# EAGLE design badge-v2 (EAGLE 6.2)
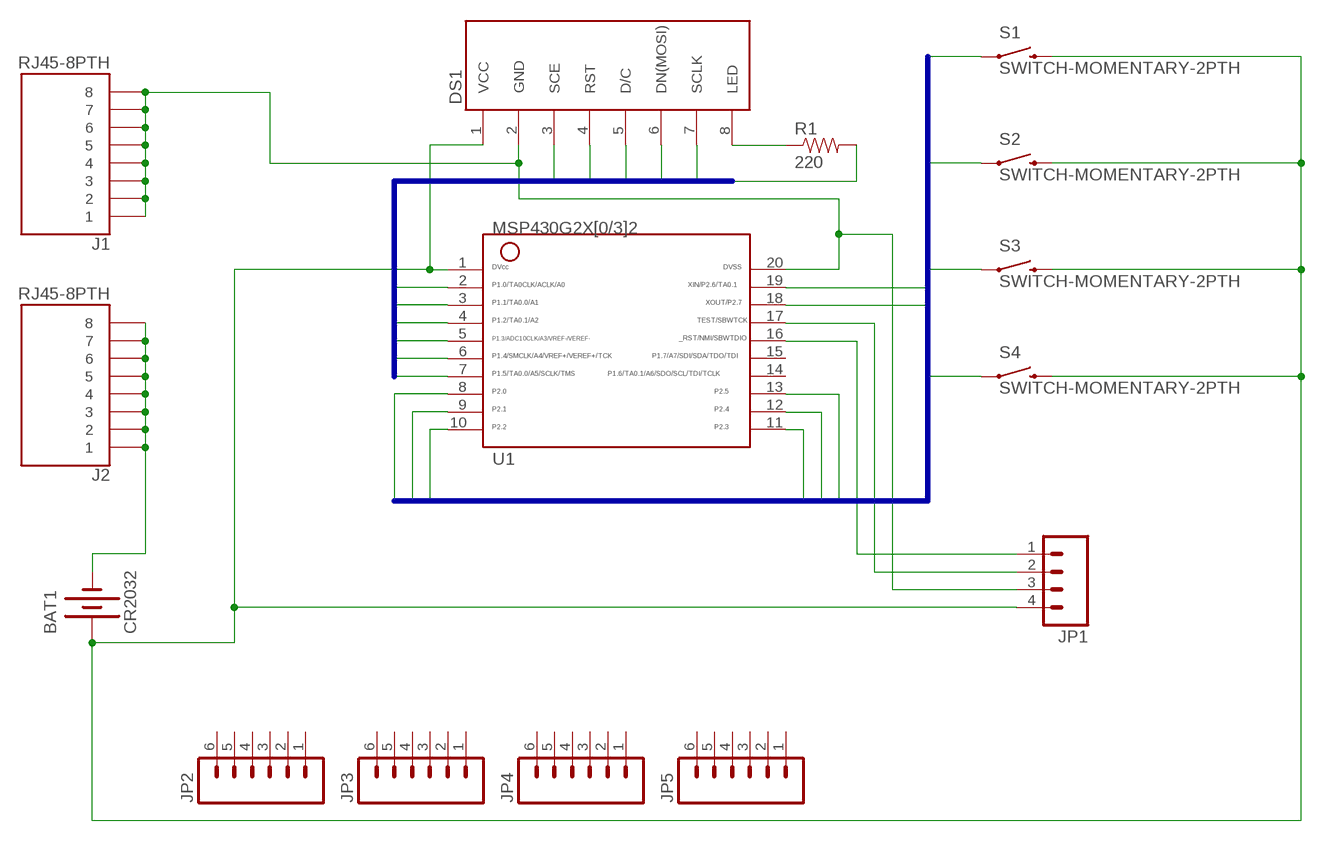
[diagram p0: schematic, sheet 1]

## Parts
BAT1  CR2032  BATTERY  [BATTCOM_20MM_4LEGS_PTH]
DS1  NOK_5110_LCD  [1X08]
J1  RJ45-8PTH  [RJ45-8]
J2  RJ45-8PTH  [RJ45-8]
JP1  M04PTH  [1X04]
JP2  M06SIP  [1X06]
JP3  M06SIP  [1X06]
JP4  M06SIP  [1X06]
JP5  M06SIP  [1X06]
R1  220  RESISTORAXIAL-0.3  [AXIAL-0.3]
S1  SWITCH-MOMENTARY-2PTH  [TACTILE-PTH]
S2  SWITCH-MOMENTARY-2PTH  [TACTILE-PTH]
S3  SWITCH-MOMENTARY-2PTH  [TACTILE-PTH]
S4  SWITCH-MOMENTARY-2PTH  [TACTILE-PTH]
U1  G2X[0/3]2---N20  [N20]

## Nets
N$1: DS1.8(LED) R1.P$1
PORTONE0: DS1.4(RST) U1.2
PORTONE1: DS1.5(D/C) U1.3
PORTONE2: DS1.6(DN(MOSI)) U1.4
PORTONE3: DS1.7(SCLK) U1.5
PORTONE4: R1.P$2 U1.6
PORTONE5: DS1.3(SCE) U1.7
PORTTWO0: S1.1 U1.8
PORTTWO1: S2.1 U1.9
PORTTWO2: S3.1 U1.10
PORTTWO3: S4.1 U1.11
PORTTWO4: U1.12
PORTTWO5: U1.13
PORTTWO6: U1.19
PORTTWO7: U1.18
RST: JP1.1 U1.16
TEST: JP1.2 U1.17
VCC: BAT1.P$POS1(+) DS1.1(VCC) JP1.4 S1.3 S2.3 S3.3 S4.3 U1.1
VSS1: BAT1.P$NEG(-) J2.1 J2.2 J2.3 J2.4 J2.5 J2.6 J2.7 J2.8
VSS2: DS1.2(GND) J1.1 J1.2 J1.3 J1.4 J1.5 J1.6 J1.7 J1.8 JP1.3 U1.20
Unconnected: JP2.1 JP2.2 JP2.3 JP2.4 JP2.5 JP2.6 JP3.1 JP3.2 JP3.3 JP3.4 JP3.5 JP3.6 JP4.1 JP4.2 JP4.3 JP4.4 JP4.5 JP4.6 JP5.1 JP5.2 JP5.3 JP5.4 JP5.5 JP5.6 U1.14 U1.15

## Buses
PORTONE[0..5]
PORTTWO[0..7]

## Library data of the parts
BAT1 = badge-custom:BATTERY: Battery Holders Various common sizes : AA, AAA, 20mm coin cell and 12mm coin cell.
DS1 = badge-custom:NOK_5110_LCD
J1 J2 = SparkFun:RJ45-8: RJ45 Jack Simple RJ45, 8-pin connection - connector for common Cat5, Cat5e, and Cat6 Ethernet cables. Footprint not yet proven in production. Connector sku is PRT-00643; Breakout PCB sku is BOB-00716.
JP1 = SparkFun:M04: Header 4 Standard 4-pin 0.1" header. Use with straight break away headers (SKU : PRT-00116), right angle break away headers (PRT-00553), swiss pins (PRT-00743), machine pins (PRT-00117), and female headers (PRT-00115). Molex polarized connector foot print use with SKU : PRT-08231 with associated crimp pins and housings. 1MM SMD Version SKU: PRT-10208
JP2-JP5 = SparkFun:M06: Header 6 Standard 6-pin 0.1" header. Use with straight break away headers (SKU : PRT-00116), right angle break away headers (PRT-00553), swiss pins (PRT-00743), machine pins (PRT-00117), and female headers (PRT-00115). Molex polarized connector foot print use with SKU : PRT-08094 with associated crimp pins and housings. NOTES ON THE VARIANTS LOCK and LOCK_LONGPADS... This footprint was designed to help hold the alignment of a through-hole component (i.e. 6-pin header) while soldering it into place. You may notice that each hole has been shifted either up or down by 0.005 of an inch from it's more standard position (which is a perfectly straight line). This slight alteration caused the pins (the squares in the middle) to touch the edges of the holes. Because they are alternating, it causes a "brace" to hold the component in place. 0.005 has proven to be the perfect amount of "off-center" position when using our standard breakaway headers. Although looks a little odd when you look at the bare footprint, once you have a header in there, the alteration is very hard to notice. Also, if you push a header all the way into place, it is covered up entirely on the bottom side. This idea of altering the position of holes to aid alignment will be further integrated into the Sparkfun Library for other footprints. It can help hold any component with 3 or more connection pins.
R1 = SparkFun:RESISTOR: Resistor Basic schematic elements and footprints for 0603, 1206, and PTH resistors.
S1-S4 = SparkFun:SWITCH-MOMENTARY-2
U1 = TI_MSP430_v16:G2X[0/3]2---N20: MSP430G2X[0/3]2 MSP430G2x32, MSP430G2x02 PDIP (N) 20 Pin Package http://focus.ti.com/docs/prod/folders/print/msp430g2432.html

## Board
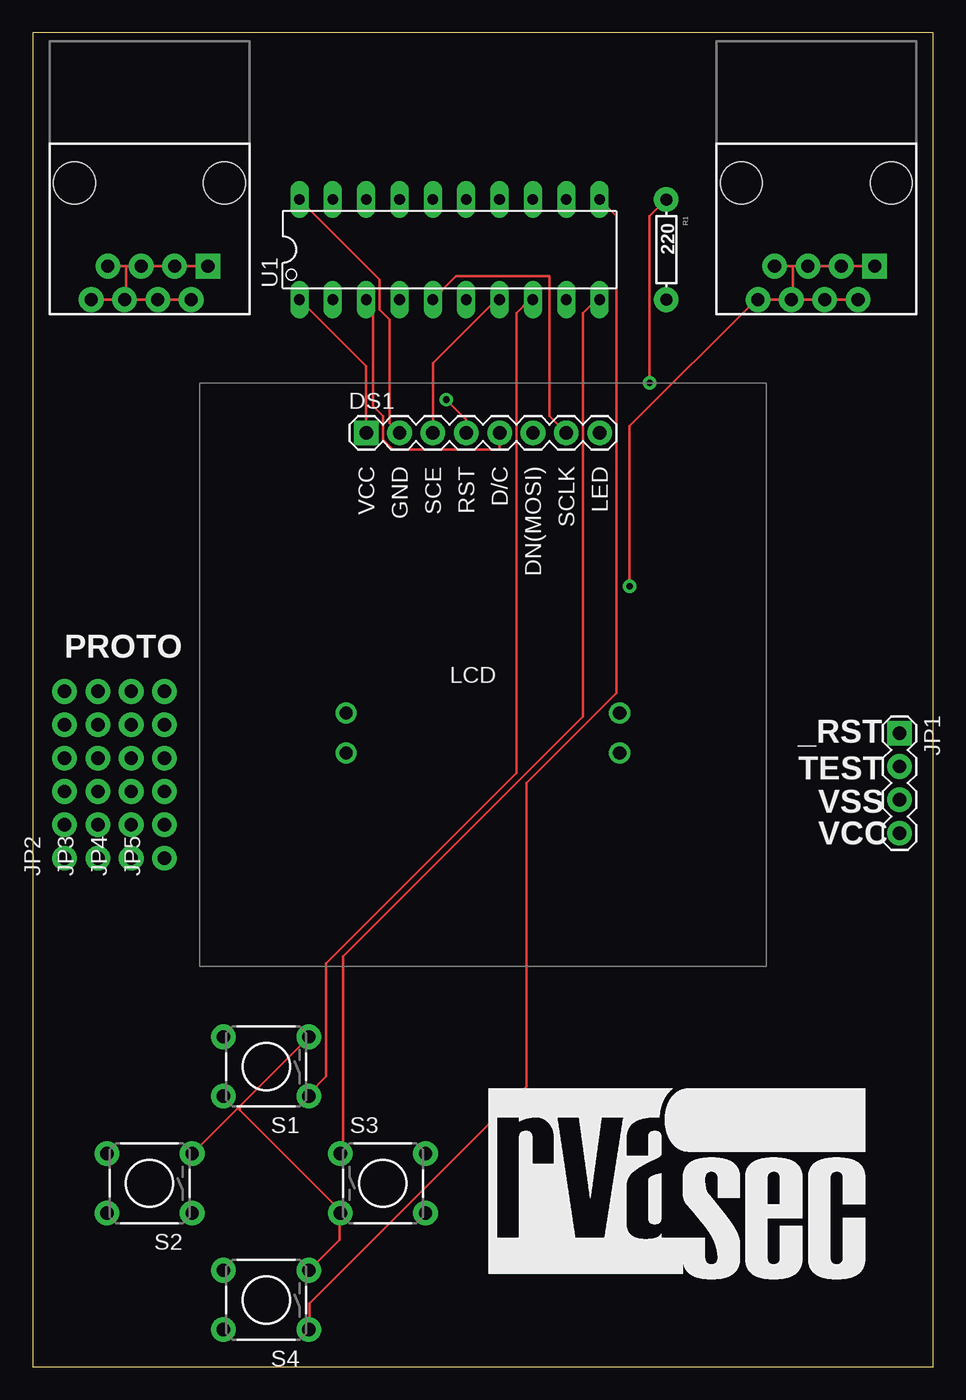
[diagram p1: board, top side]
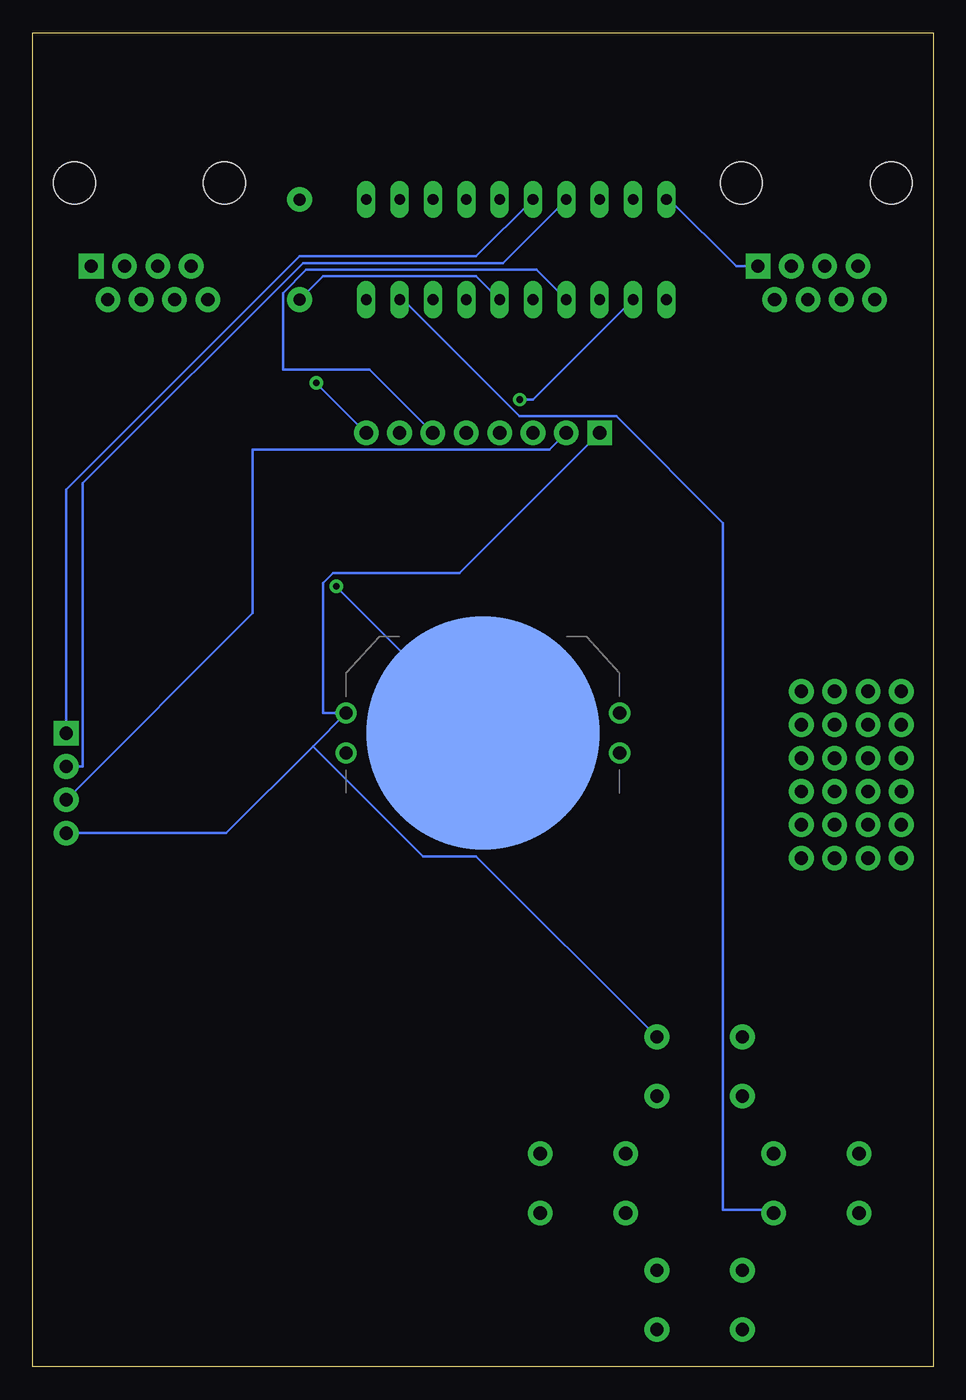
[diagram p2: board, bottom side, seen from below]

Size 68.58 x 101.6 mm. Coordinates in mm from the lower left corner, seen from the top.
Outline: 0,0 68.58,0 68.58,101.6 0,101.6 0,0
Copper layers (1*16): Top 0.035mm / dielectric 1.5mm / Bottom 0.035mm
Design rules: minimum track width 8mil, minimum drill 20mil, track to track 8mil, track to pad 8mil, pad to pad 8mil, via to via 8mil, smd to smd 8mil, copper to edge 10mil, drill to drill 8mil, minimum pad ring 12mil, minimum via ring 10mil, stop-mask expansion 4mil, vias tented up to drill 25mil, thermal gap 10mil

### Footprints (pad centres in the part's own frame; a part is rotated, then mirrored left to right if it is on the bottom)
BATTCOM_20MM_4LEGS_PTH = smd 17.78 x 17.78: P$NEG 0,0 | drill 1: P$POS1 -10.414,1.524; P$POS2 -10.414,-1.524; P$POS3 10.414,1.524; P$POS4 10.414,-1.524
1X08 = drill 1.016 pad 1.88 square: 1 0,0 | drill 1.016 pad 1.88: 2 2.54,0; 3 5.08,0; 4 7.62,0; 5 10.16,0; 6 12.7,0; 7 15.24,0; 8 17.78,0
RJ45-8 = drill 1 pad 1.88 square: 1 -4.445,6.35 | drill 1 pad 1.88: 2 -3.175,8.89; 3 -1.905,6.35; 4 -0.635,8.89; 5 0.635,6.35; 6 1.905,8.89; 7 3.175,6.35; 8 4.445,8.89 | hole 3.2: -5.715,0; 5.715,0
1X04 = drill 1.016 pad 1.88 square: 1 0,0 | drill 1.016 pad 1.88: 2 2.54,0; 3 5.08,0; 4 7.62,0
1X06 = drill 1.016 pad 1.88: 1 0,0; 2 2.54,0; 3 5.08,0; 4 7.62,0; 5 10.16,0; 6 12.7,0
AXIAL-0.3 = drill 0.9 pad 1.88: P$1 -3.81,0; P$2 3.81,0
TACTILE-PTH = drill 1.016 pad 1.88: 1 -3.251,2.261; 2 3.251,2.261; 3 -3.251,-2.261; 4 3.251,-2.261
N20 = drill 0.813 long: 1 -11.435,-3.81; 2 -8.895,-3.81; 3 -6.355,-3.81; 4 -3.815,-3.81; 5 -1.275,-3.81; 6 1.265,-3.81; 7 3.805,-3.81; 8 6.345,-3.81; 9 8.885,-3.81; 10 11.425,-3.81; 11 11.425,3.81; 12 8.885,3.81; 13 6.345,3.81; 14 3.805,3.81; 15 1.265,3.81; 16 -1.275,3.81; 17 -3.815,3.81; 18 -6.355,3.81; 19 -8.895,3.81; 20 -11.435,3.81

### Placement (x,y rotation side)
BAT1  34.29,48.26 0 bottom
DS1  25.4,71.12 0 top
J1  8.89,90.17 180 top
J2  59.69,90.17 180 top
JP1  66.04,48.26 270 top
JP2  2.41,38.73 90 top
JP3  4.95,38.73 90 top
JP4  7.49,38.73 90 top
JP5  10.03,38.73 90 top
R1  48.26,85.09 270 top
S1  17.78,22.86 180 top
S2  8.89,13.97 180 top
S3  26.67,13.97 0 top
S4  17.78,5.08 180 top
U1  31.75,85.09 0 top
U$1  [RVA_SEC_LOGO_LARGE]  34.29,6.35 0 top

### Tracks (layer width: path | path; a pad name or v marks a point on that pad's centre or on a via)
N$1  (via drill 0.51)
  Top 0.203: v46.99,74.93 46.99,87.63 R1.P$1
  Bottom 0.203: v46.99,74.93 DS1.8
PORTONE0  (via drill 0.51)
  Top 0.203: v31.5,73.66 33.02,72.14 DS1.4
  Bottom 0.203: v31.5,73.66 30.48,73.66 U1.2
PORTONE1
  Top 0.203: DS1.5 35.56,69.85 27.43,69.85 26.67,70.61 26.67,72.39 25.91,73.15 25.91,80.77 U1.3
PORTONE2
  Bottom 0.203: DS1.6 42.93,75.95 49.53,75.95 49.53,81.79 47.75,83.57 30.23,83.57 U1.4
PORTONE3
  Top 0.203: DS1.7 39.37,72.39 39.37,83.06 32.26,83.06 U1.5
PORTONE4
  Bottom 0.203: R1.P$2 46.48,83.06 34.8,83.06 U1.6
PORTONE5
  Top 0.203: DS1.3 30.48,76.45 35.31,81.28 U1.7
PORTTWO0
  Top 0.203: U1.8 37.85,81.28 36.83,80.26 36.83,45.21 22.35,30.73 22.35,22.1 21.08,20.83 S1.1
PORTTWO1
  Bottom 0.203: U1.9 40.39,81.28 31.5,72.39 24.13,72.39 16,64.26 16,11.94 12.19,11.94 S2.1
PORTTWO2
  Top 0.203: U1.10 42.93,81.28 41.91,80.26 41.91,49.53 23.62,31.24 23.62,16.26 S3.1
PORTTWO3
  Top 0.203: U1.11 44.45,87.63 44.45,51.31 37.59,44.45 37.59,21.34 21.08,4.83 21.08,3.05 S4.1
RST
  Bottom 0.203: JP1.1 66.04,66.8 48.26,84.58 34.8,84.58 U1.16
TEST
  Bottom 0.203: JP1.2 64.77,45.72 64.77,67.31 48.01,84.07 32.77,84.07 U1.17
VCC
  Top 0.203: S4.3 21.08,7.37 23.37,9.65 23.37,11.68 S3.3 23.37,11.94 15.75,19.56 15.75,19.81 | 15.75,19.81 20.83,24.89 S1.3 | 15.75,19.81 12.19,16.26 S2.3 | DS1.1 25.4,76.2 U1.1
  Bottom 0.203: 47.24,47.24 53.85,40.64 JP1.4 | 47.24,47.24 BAT1.P$POS1 46.48,49.78 46.48,59.69 45.72,60.45 36.07,60.45 DS1.1 | 47.24,47.24 38.86,38.86 34.8,38.86 21.08,25.15 S1.3
VSS1  (via drill 0.51)
  Top 0.203: J2.2 J2.4 57.91,81.28 | 57.91,83.82 J2.5 J2.3 J2.1 | 57.91,83.82 J2.7 | 57.91,83.82 57.91,81.28 | 57.91,81.28 J2.6 J2.8 55.12,81.28 45.47,71.63 v45.47,59.44
  Bottom 0.203: BAT1.P$NEG v45.47,59.44
VSS2
  Top 0.203: J1.8 J1.6 7.11,81.28 | J1.2 J1.4 7.11,81.28 | 7.11,83.82 J1.5 J1.3 J1.1 | 7.11,83.82 J1.7 | DS1.2 27.18,71.88 27.18,79.76 26.42,80.52 26.42,82.8 U1.20 | 7.11,83.82 7.11,81.28
  Bottom 0.203: J1.1 14.99,83.82 20.07,88.9 U1.20 | JP1.3 51.82,57.4 51.82,69.85 29.21,69.85 DS1.2

### Text on the board
tPlace: PROTO | _RST | TEST | VSS | VCC